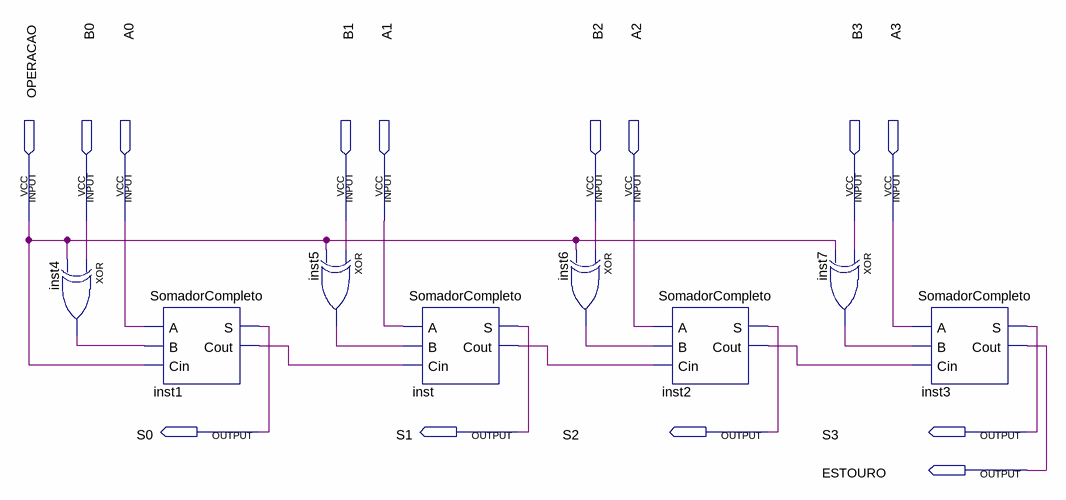
[diagram p0: schematic sheet]
// Quartus schematic subtrator_4_bits_com_complemento_de_2.bdf as structural Verilog: 8 symbols, 14 pins
module subtrator_4_bits_com_complemento_de_2 (
  input  OPERACAO,
  input  B0,
  input  A0,
  input  B1,
  input  A1,
  input  B2,
  input  A2,
  input  B3,
  input  A3,
  output S0,
  output S1,
  output S2,
  output S3,
  output ESTOURO
);

  wire inst1_cout, inst2_cout, inst4_out, inst5_out, inst6_out, inst7_out, inst_cout;

  xor inst4 (inst4_out, B0, OPERACAO);
  SomadorCompleto inst1 (.A(A0), .B(inst4_out), .Cin(OPERACAO), .S(S0), .Cout(inst1_cout));
  xor inst5 (inst5_out, B1, OPERACAO);
  SomadorCompleto inst (.A(A1), .B(inst5_out), .Cin(inst1_cout), .S(S1), .Cout(inst_cout));
  xor inst6 (inst6_out, B2, OPERACAO);
  SomadorCompleto inst2 (.A(A2), .B(inst6_out), .Cin(inst_cout), .S(S2), .Cout(inst2_cout));
  xor inst7 (inst7_out, B3, OPERACAO);
  SomadorCompleto inst3 (.A(A3), .B(inst7_out), .Cin(inst2_cout), .S(S3), .Cout(ESTOURO));
endmodule
